# Altium schematic sheet power.SchDoc
size A4
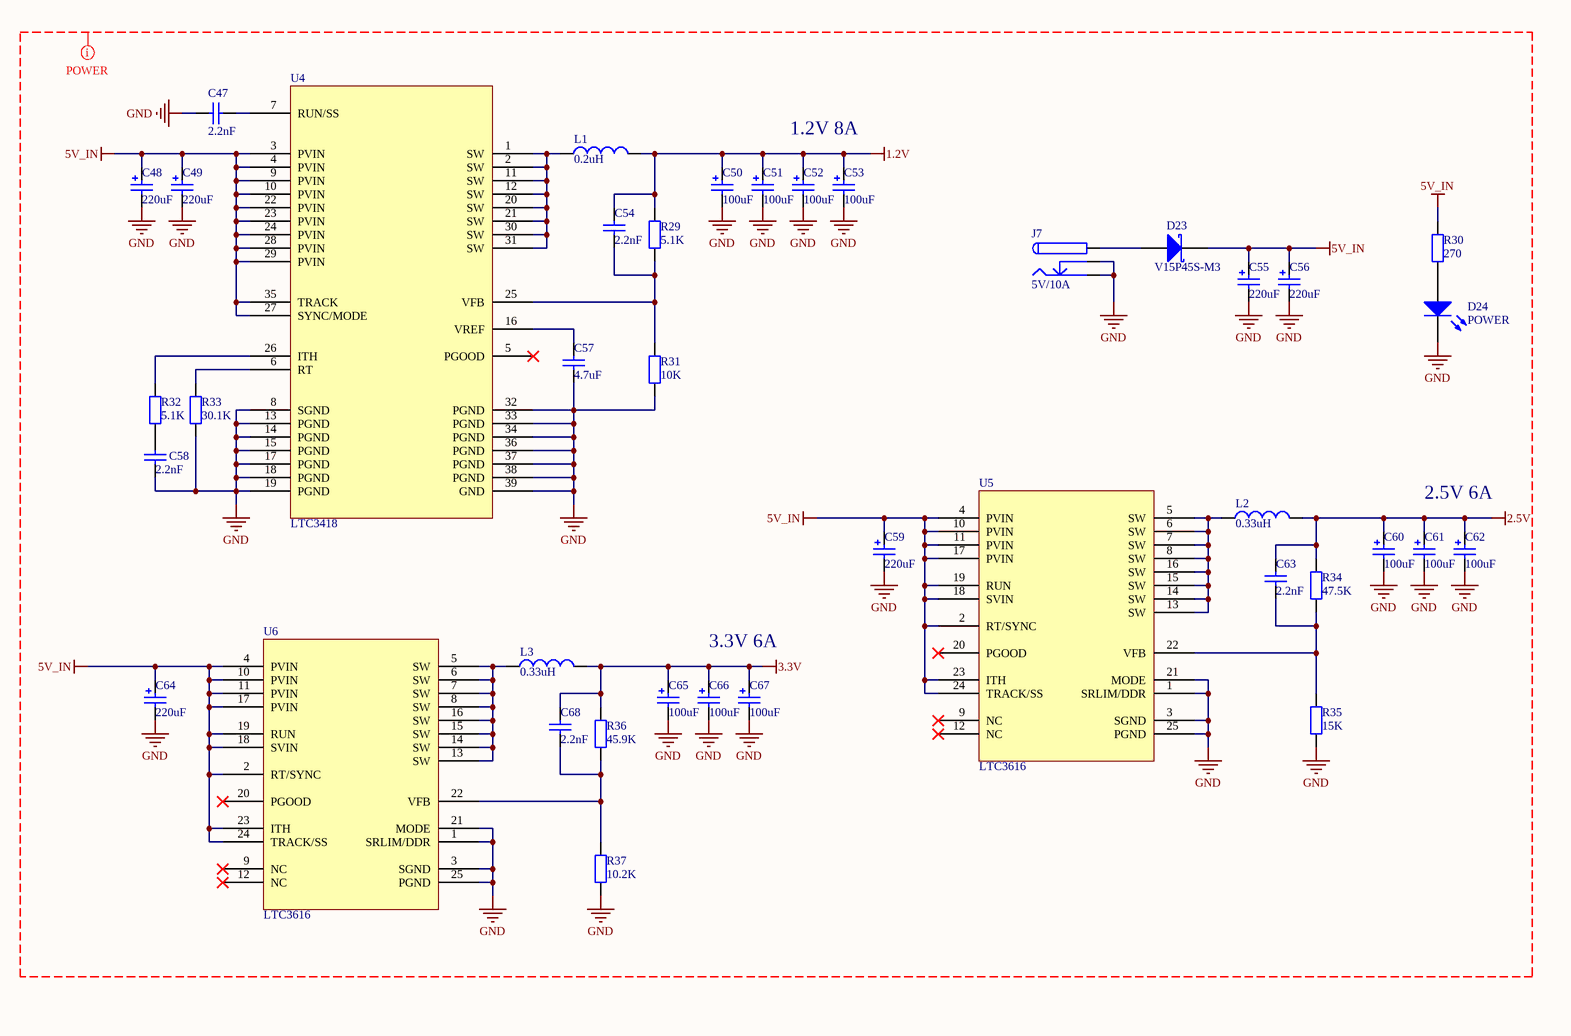
[diagram p0: power.SchDoc]

## Parts
C47  value 2.2nF  [1608[0603]]  (hidden comment: Cap)
C48  value 220uF  [C220_POLARIZED]  (hidden comment: Cap Pol2)
C49  value 220uF  [C220_POLARIZED]  (hidden comment: Cap Pol2)
C50  value 100uF  [C1206_POLARIZED]  (hidden comment: Cap Pol2)
C51  value 100uF  [C1206_POLARIZED]  (hidden comment: Cap Pol2)
C52  value 100uF  [C1206_POLARIZED]  (hidden comment: Cap Pol2)
C53  value 100uF  [C1206_POLARIZED]  (hidden comment: Cap Pol2)
C54  value 2.2nF  [1608[0603]]  (hidden comment: Cap)
C55  value 220uF  [C220_POLARIZED]  (hidden comment: Cap Pol2)
C56  value 220uF  [C220_POLARIZED]  (hidden comment: Cap Pol2)
C57  value 4.7uF  [C0805]  (hidden comment: Cap)
C58  value 2.2nF  [1608[0603]]  (hidden comment: Cap)
C59  value 220uF  [C220_POLARIZED]  (hidden comment: Cap Pol2)
C60  value 100uF  [C1206_POLARIZED]  (hidden comment: Cap Pol2)
C61  value 100uF  [C1206_POLARIZED]  (hidden comment: Cap Pol2)
C62  value 100uF  [C1206_POLARIZED]  (hidden comment: Cap Pol2)
C63  value 2.2nF  [1608[0603]]  (hidden comment: Cap)
C64  value 220uF  [C220_POLARIZED]  (hidden comment: Cap Pol2)
C65  value 100uF  [C1206_POLARIZED]  (hidden comment: Cap Pol2)
C66  value 100uF  [C1206_POLARIZED]  (hidden comment: Cap Pol2)
C67  value 100uF  [C1206_POLARIZED]  (hidden comment: Cap Pol2)
C68  value 2.2nF  [1608[0603]]  (hidden comment: Cap)
D23  V15P45S-M3  [TO-227A]
D24  POWER  [led]
J7  5V/10A  [DC_JACK]
L1  value 0.2uH  [INDP7367X100N]  (hidden comment: Inductor)
L2  value 0.33uH  [IHLP-2525CZ]  (hidden comment: Inductor)
L3  value 0.33uH  [IHLP-2525CZ]  (hidden comment: Inductor)
R29  value 5.1K  [J1-0603]  (hidden comment: Res2)
R30  value 270  [6-0805_N]  (hidden comment: Res2)
R31  value 10K  [J1-0603]  (hidden comment: Res2)
R32  value 5.1K  [J1-0603]  (hidden comment: Res2)
R33  value 30.1K  [J1-0603]  (hidden comment: Res2)
R34  value 47.5K  [J1-0603]  (hidden comment: Res2)
R35  value 15K  [J1-0603]  (hidden comment: Res2)
R36  value 45.9K  [J1-0603]  (hidden comment: Res2)
R37  value 10.2K  [J1-0603]  (hidden comment: Res2)
U4  LTC3418  [QFN38]
U5  LTC3616  [QFN24]
U6  LTC3616  [QFN24]

## Nets
1.2V: C50.1 C51.1 C52.1 C53.1 C54.2 L1.2 R29.1
2.5V: C60.1 C61.1 C62.1 C63.2 L2.2 R34.1
3.3V: C65.1 C66.1 C67.1 C68.2 L3.2 R36.1
5V_IN: C48.1 C49.1 C55.1 C56.1 C59.1 C64.1 D23.2(K) R30.1 U4.3(PVIN) U4.4(PVIN) U4.9(PVIN) U4.10(PVIN) U4.22(PVIN) U4.23(PVIN) U4.24(PVIN) U4.27(SYNC/MODE) U4.28(PVIN) U4.29(PVIN) U4.35(TRACK) U5.2(RT/SYNC) U5.4(PVIN) U5.10(PVIN) U5.11(PVIN) U5.17(PVIN) U5.18(SVIN) U5.19(RUN) U5.23(ITH) U5.24(TRACK/SS) U6.2(RT/SYNC) U6.4(PVIN) U6.10(PVIN) U6.11(PVIN) U6.17(PVIN) U6.18(SVIN) U6.19(RUN) U6.23(ITH) U6.24(TRACK/SS)
GND: C47.2 C48.2 C49.2 C50.2 C51.2 C52.2 C53.2 C55.2 C56.2 C57.1 C58.1 C59.2 C60.2 C61.2 C62.2 C64.2 C65.2 C66.2 C67.2 D24.2(K) J7.2 J7.3 R31.2 R33.2 R35.2 R37.2 U4.8(SGND) U4.13(PGND) U4.14(PGND) U4.15(PGND) U4.17(PGND) U4.18(PGND) U4.19(PGND) U4.32(PGND) U4.33(PGND) U4.34(PGND) U4.36(PGND) U4.37(PGND) U4.38(PGND) U4.39(GND) U5.1(SRLIM/DDR) U5.3(SGND) U5.21(MODE) U5.25(PGND) U6.1(SRLIM/DDR) U6.3(SGND) U6.21(MODE) U6.25(PGND)
NetC47_1: C47.1 U4.7(RUN/SS)
NetC54_1: C54.1 R29.2 R31.1 U4.25(VFB)
NetC57_2: C57.2 U4.16(VREF)
NetC58_2: C58.2 R32.2
NetC63_1: C63.1 R34.2 R35.1 U5.22(VFB)
NetC68_1: C68.1 R36.2 R37.1 U6.22(VFB)
NetD23_1: D23.1(A) J7.1
NetD24_1: D24.1(A) R30.2
NetL1_1: L1.1 U4.1(SW) U4.2(SW) U4.11(SW) U4.12(SW) U4.20(SW) U4.21(SW) U4.30(SW) U4.31(SW)
NetL2_1: L2.1 U5.5(SW) U5.6(SW) U5.7(SW) U5.8(SW) U5.13(SW) U5.14(SW) U5.15(SW) U5.16(SW)
NetL3_1: L3.1 U6.5(SW) U6.6(SW) U6.7(SW) U6.8(SW) U6.13(SW) U6.14(SW) U6.15(SW) U6.16(SW)
NetR32_1: R32.1 U4.26(ITH)
NetR33_1: R33.1 U4.6(RT)

Not connected (* = marked no-connect by the designer): U4 5(PGOOD)*; U5 9(NC)* 12(NC)* 20(PGOOD)*; U6 9(NC)* 12(NC)* 20(PGOOD)*

## Layout directives
net class POWER: 1.2V, 2.5V, 3.3V, 5V_IN, GND

## Notes on the sheet
- 1.2V 8A
- 2.5V 6A
- 3.3V 6A

## Library data of the parts
C47 C54 C57 C58 C63 C68 = Cap: Capacitor; Published: 8-Jun-2000; LatestRevisionDate: 17-Jul-2002; LatestRevisionNote: Re-released for DXP Platform.; PackageReference: RAD-0.3; Publisher: Altium Limited; PackageDescription: Radial Cap, Thru-Hole; 2 Leads; 0.3 in Pin Spacing
C48-C53 C55 C56 C59-C62 C64-C67 = Cap Pol2: Polarized Capacitor (Axial); Published: 8-Jun-2000; LatestRevisionDate: 17-Jul-2002; LatestRevisionNote: Re-released for DXP Platform.; PackageReference: POLAR0.8; Publisher: Altium Limited; PackageDescription: Polarized Capacitor; 2 Leads
D23 = D Schottky: Schottky Diode; Published: 8-Jun-2000; LatestRevisionDate: 17-Jul-2002; LatestRevisionNote: Re-released for DXP Platform.; PackageReference: SMB; Publisher: Altium Limited; PackageDescription: DO-214-AA/SMB; 2 C-Bend Leads; Body 5.3 x 3.6 mm, inc. leads (LxW); Code_JEDEC: DO-214-AA
D24 = LED3: Green; Published: 8-Jun-2000; LatestRevisionDate: 17-Dec-2003; LatestRevisionNote: PCB Footprint replaced.; DatasheetVersion: 16-Apr-2002; PackageVersion: 16-Apr-2002; PackageReference: 3.5X2.8X1.9; Publisher: Altium Limited; PackageDescription: SM LED; 2 C-Bend Leads; Body 3.5 x 2.8 x 1.9 mm, inc leads (LxWxH typ)
J7 = PWR2.5: Low Voltage Power Supply Connector; Published: 17-Dec-2003; DatasheetDocument: 09-May-2002; Publisher: Altium Limited; ComponentLink1Description: Manufacturer Link; ComponentLink1URL: http://domino.kycon.com/internet/Products.html
L1-L3 = Inductor: Code_IEC: 1005; Published: 8-Jun-2000; LatestRevisionDate: 29-May-2009; LatestRevisionNote: IPC-7351 Footprint Added.; PackageReference: 0402-A; Publisher: Altium Limited; PackageDescription: Chip Inductor; Code_JEITA: 0402
R29-R37 = Res2: Resistor; Published: 8-Jun-2000; LatestRevisionDate: 17-Jul-2002; LatestRevisionNote: Re-released for DXP Platform.; PackageReference: AXIAL-0.4; Publisher: Altium Limited; PackageDescription: Axial Device, Thru-Hole; 2 Leads; 0.4 in Pin Spacing
U5 U6 = LTC3616: Step-Down, 6A, 4MHz